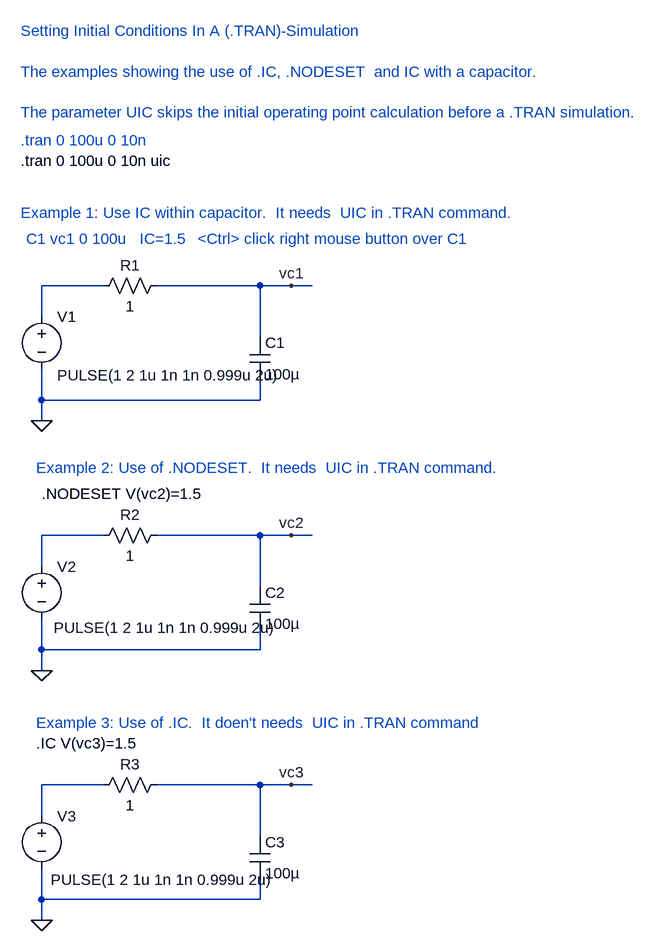
[diagram p0: schematic Ic_Nodeset_test.asc]
Ic_Nodeset_test.asc, the LTspice schematic file:
Version 4
SHEET 1 1272 1248
WIRE 256 256 256 176
WIRE 256 176 96 176
WIRE 16 176 -80 176
WIRE 256 320 256 352
WIRE 336 176 304 176
WIRE 256 352 -80 352
WIRE -80 176 -80 224
WIRE -80 304 -80 352
WIRE -80 384 -80 352
WIRE 304 176 256 176
WIRE 256 640 256 560
WIRE 256 560 96 560
WIRE 16 560 -80 560
WIRE 256 704 256 736
WIRE 336 560 304 560
WIRE 256 736 -80 736
WIRE -80 560 -80 608
WIRE -80 688 -80 736
WIRE -80 768 -80 736
WIRE 304 560 256 560
WIRE 256 1024 256 944
WIRE 256 944 96 944
WIRE 16 944 -80 944
WIRE 256 1088 256 1120
WIRE 336 944 304 944
WIRE 256 1120 -80 1120
WIRE -80 944 -80 992
WIRE -80 1072 -80 1120
WIRE -80 1152 -80 1120
WIRE 304 944 256 944
FLAG -80 384 0
FLAG 304 176 vc1
FLAG -80 768 0
FLAG 304 560 vc2
FLAG -80 1152 0
FLAG 304 944 vc3
SYMBOL res 0 192 R270
WINDOW 0 32 56 VTop 0
WINDOW 3 0 56 VBottom 0
SYMATTR InstName R1
SYMATTR Value 1
SYMBOL cap 240 256 R0
SYMATTR InstName C1
SYMATTR Value 100µ
SYMATTR Value2 IC=1.5
SYMBOL voltage -80 208 R0
WINDOW 3 24 106 Left 0
WINDOW 123 0 0 Left 0
WINDOW 39 0 0 Left 0
SYMATTR InstName V1
SYMATTR Value PULSE(1 2 1u 1n 1n 0.999u 2u)
SYMBOL res 0 576 R270
WINDOW 0 32 56 VTop 0
WINDOW 3 0 56 VBottom 0
SYMATTR InstName R2
SYMATTR Value 1
SYMBOL cap 240 640 R0
SYMATTR InstName C2
SYMATTR Value 100µ
SYMBOL voltage -80 592 R0
WINDOW 3 19 110 Left 0
WINDOW 123 0 0 Left 0
WINDOW 39 0 0 Left 0
SYMATTR InstName V2
SYMATTR Value PULSE(1 2 1u 1n 1n 0.999u 2u)
SYMBOL res 0 960 R270
WINDOW 0 32 56 VTop 0
WINDOW 3 0 56 VBottom 0
SYMATTR InstName R3
SYMATTR Value 1
SYMBOL cap 240 1024 R0
SYMATTR InstName C3
SYMATTR Value 100µ
SYMBOL voltage -80 976 R0
WINDOW 3 14 114 Left 0
WINDOW 123 0 0 Left 0
WINDOW 39 0 0 Left 0
SYMATTR InstName V3
SYMATTR Value PULSE(1 2 1u 1n 1n 0.999u 2u)
TEXT -112 -48 Left 0 ;.tran 0 100u 0 10n
TEXT -88 880 Left 0 !.IC V(vc3)=1.5
TEXT -80 496 Left 0 !.NODESET V(vc2)=1.5
TEXT -104 104 Left 0 ;C1 vc1 0 100u   IC=1.5
TEXT 160 104 Left 0 ;<Ctrl> click right mouse button over C1
TEXT -112 64 Left 0 ;Example 1: Use IC within capacitor.  It needs  UIC in .TRAN command.
TEXT -88 456 Left 0 ;Example 2: Use of .NODESET.  It needs  UIC in .TRAN command.
TEXT -88 848 Left 0 ;Example 3: Use of .IC.  It doen't needs  UIC in .TRAN command
TEXT -112 -16 Left 0 !.tran 0 100u 0 10n uic
TEXT -112 -216 Left 0 ;Setting Initial Conditions In A (.TRAN)-Simulation\n \nThe examples showing the use of .IC, .NODESET  and IC with a capacitor.\n \nThe parameter UIC skips the initial operating point calculation before a .TRAN simulation.

The netlist it stands for:
* Ic_Nodeset_test.asc
R1 N001 vc1 1
C1 vc1 0 100µ IC=1.5
V1 N001 0 PULSE(1 2 1u 1n 1n 0.999u 2u)
R2 N002 vc2 1
C2 vc2 0 100µ
V2 N002 0 PULSE(1 2 1u 1n 1n 0.999u 2u)
R3 N003 vc3 1
C3 vc3 0 100µ
V3 N003 0 PULSE(1 2 1u 1n 1n 0.999u 2u)
* .tran 0 100u 0 10n
.IC V(vc3)=1.5
.NODESET V(vc2)=1.5
* C1 vc1 0 100u   IC=1.5
* <Ctrl> click right mouse button over C1
* Example 1: Use IC within capacitor.  It needs  UIC in .TRAN command.
* Example 2: Use of .NODESET.  It needs  UIC in .TRAN command.
* Example 3: Use of .IC.  It doen't needs  UIC in .TRAN command
.tran 0 100u 0 10n uic
* Setting Initial Conditions In A (.TRAN)-Simulation
* The examples showing the use of .IC, .NODESET  and IC with a capacitor.
* The parameter UIC skips the initial operating point calculation before a .TRAN simulation.
.backanno
.end